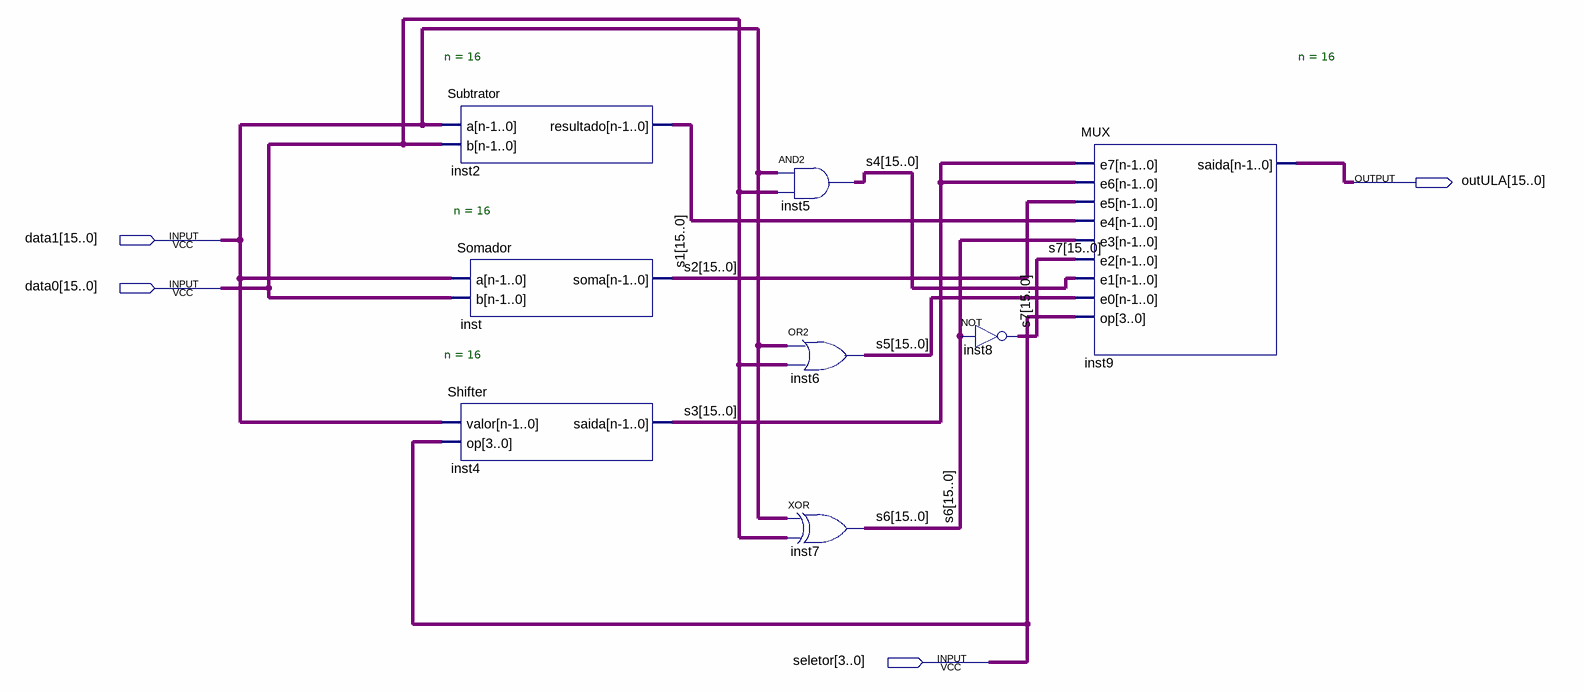
[diagram p0: schematic sheet]
// Quartus schematic procULA.bdf as structural Verilog: 8 symbols, 4 pins
module procULA (
  input  [15:0] data1,
  input  [15:0] data0,
  input  [3:0] seletor,
  output [15:0] outULA
);

  wire [15:0] s1, s2, s3, s4, s5, s6, s7;

  Subtrator #(.n(16)) inst2 (.a(data1), .b(data0), .resultado(s1));
  Somador #(.n(16)) inst (.a(data1), .b(data0), .soma(s2));
  Shifter #(.n(16)) inst4 (.valor(data1), .op(seletor), .saida(s3));
  assign s4 = data1 & data0;  // AND2 inst5, 16 bits wide
  assign s5 = data1 | data0;  // OR2 inst6, 16 bits wide
  assign s6 = data1 ^ data0;  // XOR inst7, 16 bits wide
  assign s7 = ~s6;  // NOT inst8, 16 bits wide
  MUX #(.n(16)) inst9 (
    .e7(s3), .e6(s3), .e5(s2), .e4(s1), .e3(s6), .e2(s7), .e1(s4), .e0(s5), .op(seletor), .saida(outULA));
endmodule
